# EAGLE design piezo-buffer-and-preamp-ritter_V0-4-thru (EAGLE 7.6.0)
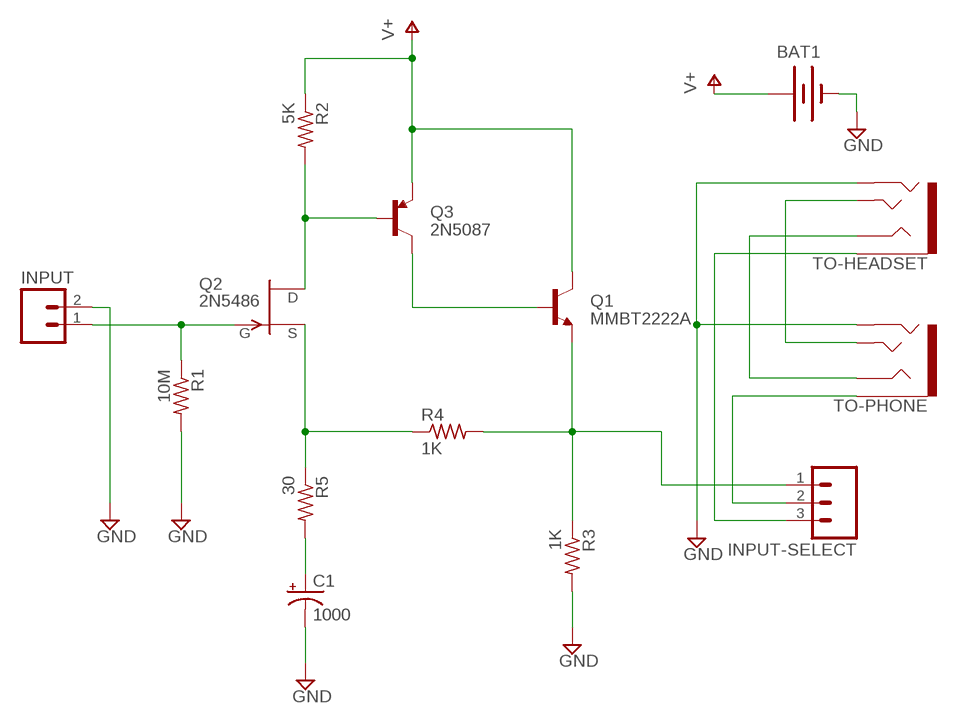
[diagram p0: schematic, sheet 1]

## Parts
BAT1  BATTERYAAA-KIT  [BATTERY-AAA-KIT]
C1  1000  CAP_POLPTH4  [CPOL-RADIAL-1000UF-25V]
INPUT  M02LOCK  [1X02_LOCK]
INPUT-SELECT  M03LOCK  [1X03_LOCK]
Q1  MMBT2222A  TRANSISTOR_NPNTO92  [TO-92]
Q2  2N5486  [TO92-]
Q3  2N5087  TRANSISTOR_PNPTO92  [TO-92]
R1  10M  R-US_V526-0  [V526-0]
R2  5K  R-US_V526-0  [V526-0]
R3  1K  R-US_V526-0  [V526-0]
R4  1K  R-US_V526-0  [V526-0]
R5  30  R-US_V526-0  [V526-0]
TO-HEADSET  AUDIO-JACK3  [AUDIO-JACK-TRRS-SMD]
TO-PHONE  AUDIO-JACK3  [AUDIO-JACK-TRRS-SMD]

## Nets
`DEL: INPUT-SELECT.1 Q1.1(E) R3.1 R4.2
GND: BAT1.GND@1(-) C1.- INPUT.2 R1.2 R3.2 TO-HEADSET.RING2 TO-PHONE.RING2
N$1: INPUT.1 Q2.1(G) R1.1
N$2: Q2.3(D) Q3.2(B) R2.2
N$4: Q2.2(S) R4.1 R5.1
N$5: Q1.2(B) Q3.3(C)
N$6: C1.+ R5.2
N$7: INPUT-SELECT.3 TO-HEADSET.EARTH
N$8: TO-HEADSET.TIP TO-PHONE.TIP
N$9: TO-HEADSET.RING1 TO-PHONE.RING1
TO-PHONE: INPUT-SELECT.2 TO-PHONE.EARTH
V+: BAT1.PWR@1(+) Q1.3(C) Q3.1(E) R2.1

## Library data of the parts
BAT1 = Daniel:BATTERY: Battery Holders Various common sizes : AA, AAA, 18650 (PRT-12895), 20mm coin cell and 12mm coin cell. 20MM_4LEGS, BATT-10373; PROD_ID: BATT-08571
C1 = SparkFun-Capacitors:CAP_POL: Capacitor Polarized These are standard SMD and PTH capacitors. Normally 10uF, 47uF, and 100uF in electrolytic and tantalum varieties. Always verify the external diameter of the through hole cap, it varies with capacity, voltage, and manufacturer. The EIA devices should be standard.
INPUT = CMU-ArtFab:M02: Header 2 Standard 2-pin 0.1" header. Use with straight break away headers (SKU : PRT-00116), right angle break away headers (PRT-00553), swiss pins (PRT-00743), machine pins (PRT-00117), and female headers (PRT-00115). Molex polarized connector foot print use with SKU : PRT-08233 with associated crimp pins and housings.
INPUT-SELECT = SparkFun-Connectors:M03: Header 3 Standard 3-pin 0.1" header. Use with straight break away headers (SKU : PRT-00116), right angle break away headers (PRT-00553), swiss pins (PRT-00743), machine pins (PRT-00117), and female headers (PRT-00115). Molex polarized connector foot print use with SKU : PRT-08232 with associated crimp pins and housings.
Q1 = CMU-ArtFab:TRANSISTOR_NPN: Generic NPN BJT MMBT2222A - TRANS-08049 (SOT-23, 1A 40V) MPSA42 - TRANS-09116 (SOT-23, 500mA 300V) MMBT5088LT1G - TRANS-11160 (SOT-23, 50 mA 30V) BC547 - COM-08928 <http://www.sparkfun.com/products/8928> (TO-92 45V 100mA) (1.Collector 2.Base 3.Emitter) 2N3904 - COM-00521 <http://www.sparkfun.com/products/521> (TO-92 40V 200mA) (1.Emitter 2.Base 3.Collector) P2N2222A - COM-12852 <http://www.sparkfun.com/products/12852> (TO-92 40V 600mA) (1.Collector 2.Base 3.Emitter)
Q2 = transistor-fet:?548*: N-Channel JFETs Source: VISHAY 2N5484.pdf Compatible: TO92 2N5245 J304 J305 U310 J308 J309 J310 TO72 2N4416 2N4416A 2N3823 2N4351 3N169 3N170 3N171 MFE3002 TO18 2N3796 2N3797 MFE825 Source: Motorola European Master Guide Pacge 3-59
Q3 = CMU-ArtFab:TRANSISTOR_PNP: Generic PNP BJT Double check pinouts against datasheets- not all devices are the same! MMBT3906 - 40V 200mA SOT-23 (TRANS-08052) MMBT4403 - 40V 600mA SOT-23 (TRANS-09245)
R1-R5 = resistor:R-US_: RESISTOR, American symbol
TO-HEADSET TO-PHONE = SparkFun-Connectors:AUDIO-JACK3: Audio jack - 3.5mm TRRS variety - two rings.

## Board
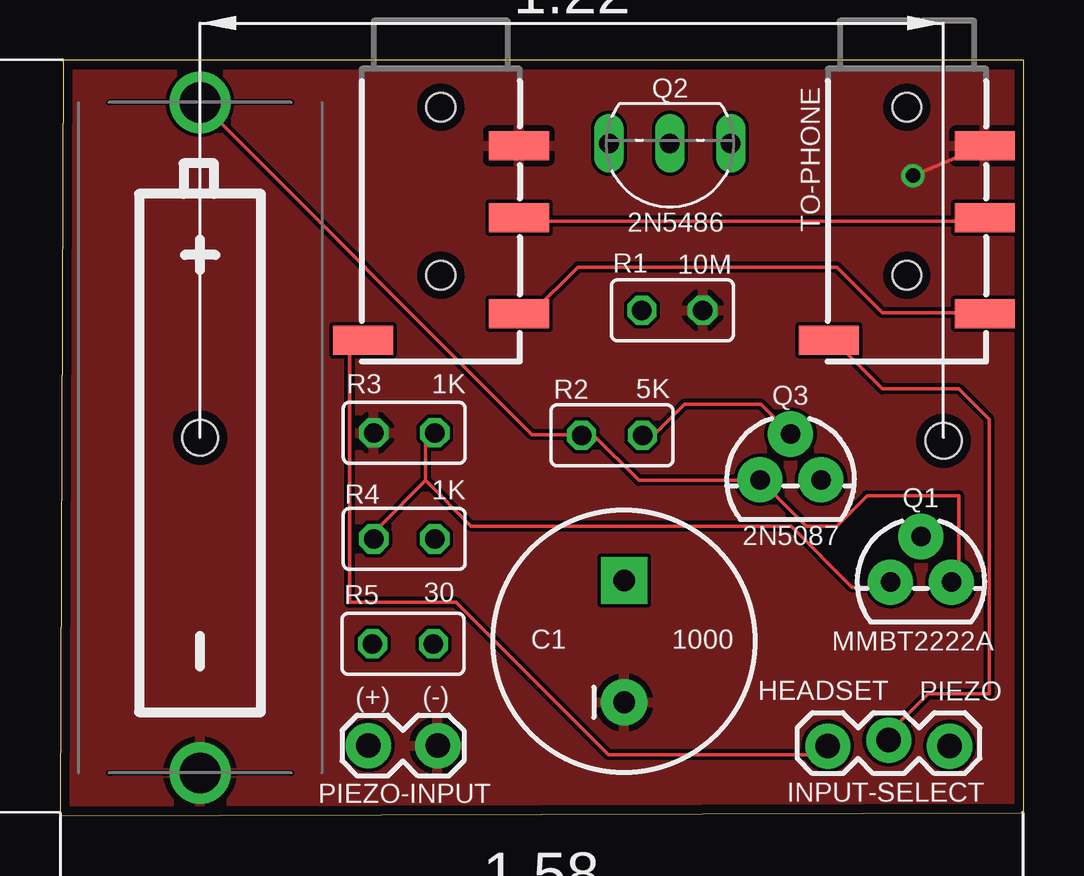
[diagram p1: board, top side]
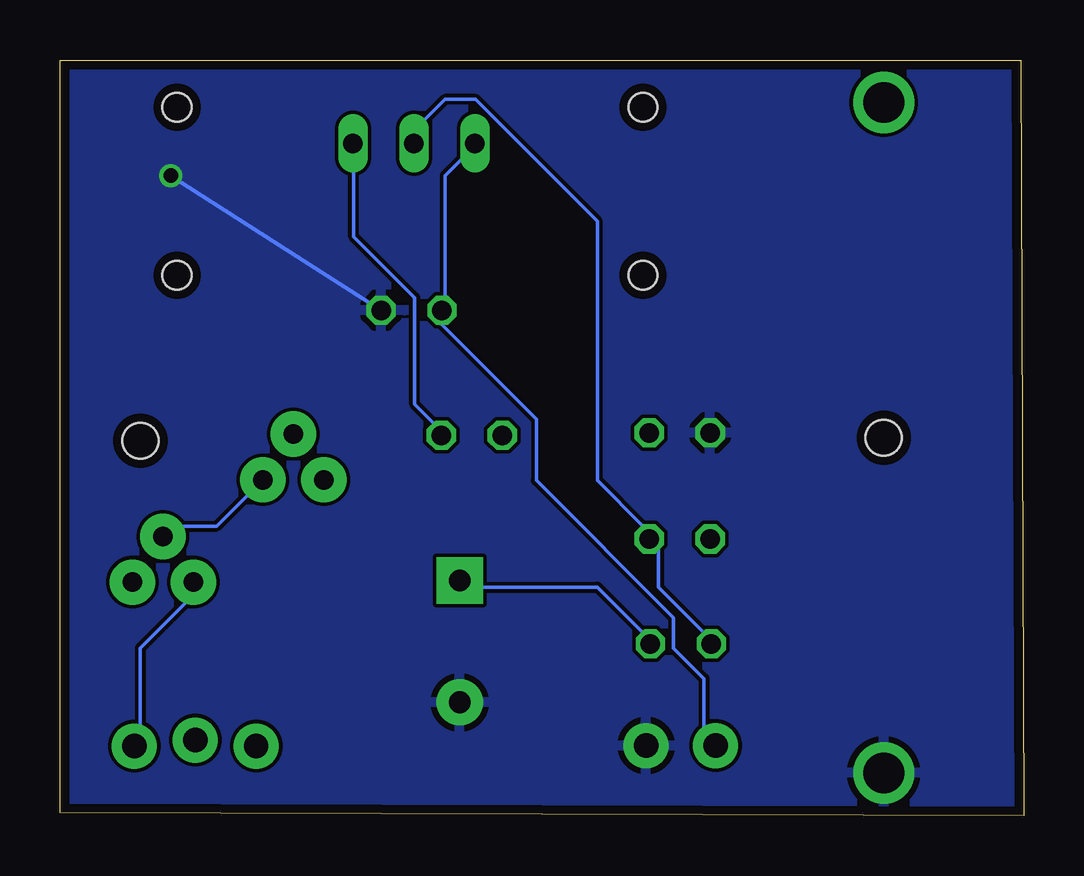
[diagram p2: board, bottom side, seen from below]

Size 40.18 x 31.49 mm. Coordinates in mm from the lower left corner, seen from the top.
Outline: 0,0 40.18,0.13 40.18,31.49 0.13,31.49 0,0
Copper layers (1*16): Top 0.0356mm / dielectric 1.5011mm / Bottom 0.0356mm
Design rules "oshpark-2layer": minimum track width 6mil, minimum drill 13mil, track to track 6mil, track to pad 6mil, pad to pad 6mil, via to via 6mil, smd to smd 6mil, copper to edge 15mil, drill to drill 6mil, minimum pad ring 7mil, minimum via ring 7mil, stop-mask expansion 2.5mil, vias tented up to drill 0mil, thermal gap 10mil
Holes 1.5 mm at 36.83,15.62 5.84,15.75

### Footprints (pad centres in the part's own frame; a part is rotated, then mirrored left to right if it is on the bottom)
BATTERY-AAA-KIT = drill 1.702: GND@1 13.97,0; PWR@1 -13.97,0
CPOL-RADIAL-1000UF-25V = drill 0.9 pad 1.93 square: + 2.54,0 | drill 0.9 pad 1.93: - -2.54,0
1X02_LOCK = drill 1.016 pad 1.88: 1 -0.178,0; 2 2.718,0
1X03_LOCK = drill 1.016 pad 1.88: 1 0,0.127; 2 2.54,-0.127; 3 5.08,0.127
TO-92 = drill 0.813 pad 1.88: 1 -1.27,0; 2 0,1.905; 3 1.27,0
TO92- = drill 0.813 long: 1 2.54,0; 2 0,0; 3 -2.54,0
V526-0 = drill 0.813 octagon: 1 -1.27,0; 2 1.27,0
AUDIO-JACK-TRRS-SMD = smd 1.2 x 2.5: EARTH 11.3,-3.25; RING1 6.2,3.25; RING2 3.2,3.25; TIP 10.2,3.25 | hole 1.2: 1.6,0; 8.6,0

### Placement (x,y rotation side)
BAT1  5.84,15.75 270 top
C1  23.52,7.26 90 top
INPUT  13.03,2.92 0 top
INPUT-SELECT  37.08,3.02 180 top
Q1  35.89,9.73 0 top
Q2  25.43,28.02 180 top
Q3  30.45,14 0 top
R1  25.53,21.06 0 top
R2  23.01,15.85 0 top
R3  14.35,15.95 180 top
R4  14.35,11.53 180 top
R5  14.3,7.16 0 top
TO-HEADSET  15.88,31.11 270 top
TO-PHONE  35.31,31.11 270 top

### Tracks (layer width: path | path; a pad name or v marks a point on that pad's centre or on a via)
`DEL
  Top 0.152: 15.24,13.97 13.34,12.06 R4.2 | 15.24,13.97 15.24,15.88 R3.1 | 15.24,13.97 17.14,12.06 30.48,12.06 33.02,9.53 34.29,9.53 Q1.1
  Bottom 0.152: INPUT-SELECT.1 36.83,3.17 36.83,6.99 34.29,9.53 Q1.1
GND  (via drill 0.6)
  Top 0.152: TO-PHONE.RING2 v35.56,26.67
  Bottom 0.152: v35.56,26.67 R1.2
  pour Top: 0,0.13 40.13,0.13 40.13,31.11 0,31.11
  pour Bottom: 0,0.13 40.13,0.13 40.13,31.11 0,31.11
N$1
  Bottom 0.152: Q2.1 22.86,27.94 24.13,26.67 24.13,21.59 R1.1 24.77,20.95 20.32,16.51 20.32,13.97 14.61,8.26 14.61,6.99 13.34,5.71 13.34,3.17 INPUT.1
N$2
  Top 0.152: Q3.2 29.21,17.14 26.04,17.14 24.77,15.88 R2.2
  Bottom 0.152: Q2.3 27.94,27.94 27.94,24.13 25.4,21.59 25.4,17.14 24.13,15.88 R2.2
N$4
  Bottom 0.152: R5.1 13.34,7.62 15.24,9.53 15.24,11.43 R4.1 15.88,12.06 17.78,13.97 17.78,24.77 22.86,29.84 24.13,29.84 25.4,28.57 Q2.2
N$5
  Bottom 0.152: Q3.3 33.66,12.06 35.56,12.06 Q1.2
N$6
  Bottom 0.152: R5.2 15.88,7.62 17.78,9.53 23.5,9.53 C1.+
N$7
  Top 0.152: TO-HEADSET.EARTH 12.06,19.68 12.06,8.89 16.51,8.89 22.86,2.54 31.75,2.54 INPUT-SELECT.3
N$8
  Top 0.152: TO-HEADSET.TIP 19.68,20.95 21.59,22.86 32.38,22.86 34.29,20.95 38.1,20.95 TO-PHONE.TIP
N$9
  Top 0.152: TO-HEADSET.RING1 19.68,24.77 38.1,24.77 TO-PHONE.RING1
TO-PHONE
  Top 0.152: TO-PHONE.EARTH 32.38,19.68 34.29,17.78 37.47,17.78 38.73,16.51 38.73,5.08 36.2,5.08 34.29,3.17 INPUT-SELECT.2
V+
  Top 0.152: Q1.3 37.47,10.16 37.47,13.34 33.66,13.34 32.38,12.06 31.11,12.06 Q3.1 28.57,13.97 24.13,13.97 22.23,15.88 R2.1 21.59,15.88 19.68,15.88 BAT1.PWR@1